# Altium schematic sheet Audio_Codec.SchDoc: Audio Research: Audio Codec
size A4; DrawnBy: Connor Dack; Engineer: Connor Dack; DocumentNumber: 4; Revision: 1.0; SheetNumber: 4; SheetTotal: 20
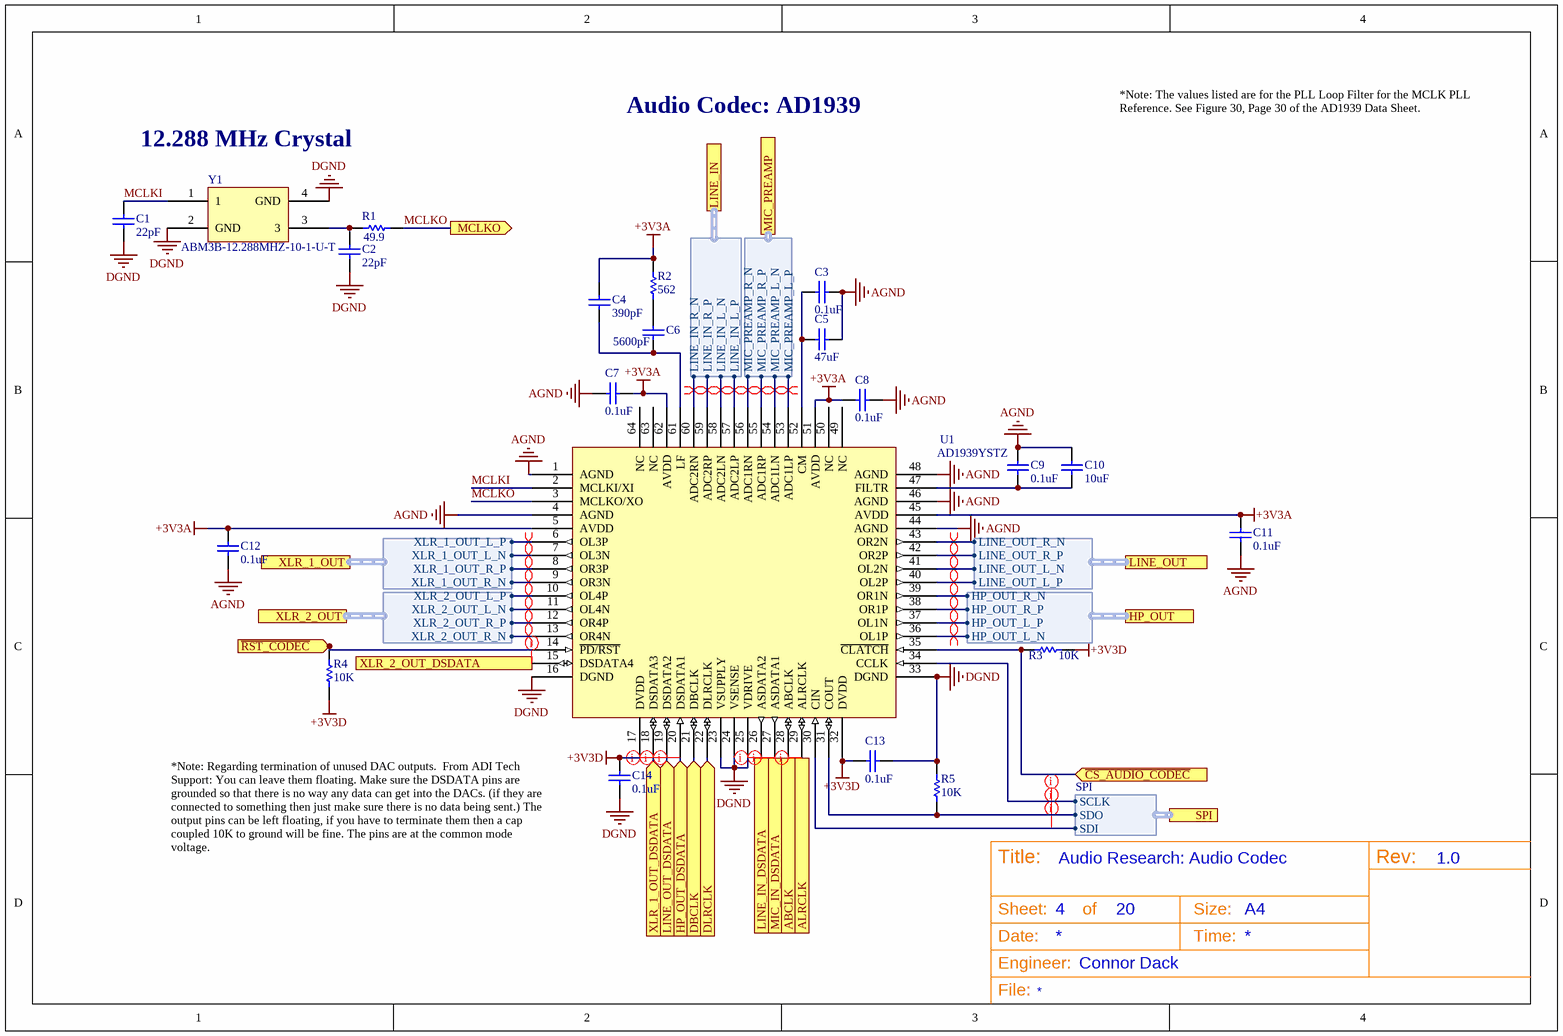
[diagram p0: Audio_Codec.SchDoc]

## Parts
C1  Capacitance: 22pF  [3-0603_L]  (hidden comment: CGA3E2C0G1H220J080AA)
C2  Capacitance: 22pF  [3-0603_L]  (hidden comment: CGA3E2C0G1H220J080AA)
C3  Capacitance: 0.1uF  [3-0603_L]  (hidden comment: CL10F104ZO8NNNC)
C4  Capacitance: 390pF  [3-0603_L]  (hidden comment: CL10B391KB8NNNC)
C5  Capacitance: 47uF  [C1210X25_L]  (hidden comment: CL32A476KOJNNNE)
C6  Capacitance: 5600pF  [3-0603_L]  (hidden comment: CL10B562KB8SFNC)
C7  Capacitance: 0.1uF  [3-0603_L]  (hidden comment: CL10F104ZO8NNNC)
C8  Capacitance: 0.1uF  [3-0603_L]  (hidden comment: CL10F104ZO8NNNC)
C9  Capacitance: 0.1uF  [3-0603_L]  (hidden comment: CL10F104ZO8NNNC)
C10  Capacitance: 10uF  [3-0603_L]  (hidden comment: GRM188R61A106ME69D)
C11  Capacitance: 0.1uF  [3-0603_L]  (hidden comment: CL10F104ZO8NNNC)
C12  Capacitance: 0.1uF  [3-0603_L]  (hidden comment: CL10F104ZO8NNNC)
C13  Capacitance: 0.1uF  [3-0603_L]  (hidden comment: CL10F104ZO8NNNC)
C14  Capacitance: 0.1uF  [3-0603_L]  (hidden comment: CL10F104ZO8NNNC)
R1  Resistance (Ohms): 49.9  [3-0603_R_L]  (hidden comment: ERJ-3EKF49R9V)
R2  Resistance (Ohms): 562  [3-0603_R_L]  (hidden comment: ERJ-3EKF5620V)
R3  Resistance (Ohms): 10K  [3-0603_R_L]  (hidden comment: ERJ-3GEYJ103V)
R4  Resistance (Ohms): 10K  [3-0603_R_L]  (hidden comment: ERJ-3GEYJ103V)
R5  Resistance (Ohms): 10K  [3-0603_R_L]  (hidden comment: ERJ-3GEYJ103V)
U1  AD1939YSTZ  [ST_64_2]
Y1  ABM3B-12.288MHZ-10-1-U-T  [ADM3B]

## Ports
ABCLK (out), ALRCLK (out), DBCLK (in), DLRCLK (in), HP_OUT (harness HP_OUT), HP_OUT_DSDATA (in), LINE_IN (harness LINE_IN), LINE_IN_DSDATA (out), LINE_OUT (harness LINE_OUT), LINE_OUT_DSDATA (in), MCLKO (out), MIC_IN_DSDATA (out), MIC_PREAMP (harness MIC_PREAMP), SPI (harness SPI), XLR_1_OUT (harness XLR_1_OUT), XLR_1_OUT_DSDATA (in), XLR_2_OUT (harness XLR_2_OUT), XLR_2_OUT_DSDATA (in), ~{CS_AUDIO_CODEC} (in), ~{RST_CODEC} (in)

## Harnesses
LINE_IN: LINE_IN_R_P, LINE_IN_R_N, LINE_IN_L_N, LINE_IN_L_P
HP_OUT: HP_OUT_L_N, HP_OUT_L_P, HP_OUT_R_N, HP_OUT_R_P
LINE_OUT: LINE_OUT_L_N, LINE_OUT_L_P, LINE_OUT_R_N, LINE_OUT_R_P
XLR_1_OUT: XLR_1_OUT_L_N, XLR_1_OUT_L_P, XLR_1_OUT_R_N, XLR_1_OUT_R_P
XLR_2_OUT: XLR_2_OUT_L_N, XLR_2_OUT_L_P, XLR_2_OUT_R_N, XLR_2_OUT_R_P
MIC_PREAMP: MIC_PREAMP_R_P, MIC_PREAMP_R_N, MIC_PREAMP_L_N, MIC_PREAMP_L_P
SPI: SDI, SCLK, SDO

## Nets
+3V3A: C4.1 C7.1 C8.2 C11.1 C12.1 R2.1 U1.5(AVDD) U1.45(AVDD) U1.51(AVDD) U1.62(AVDD)
+3V3D: C13.2 C14.1 R3.1 R4.1 U1.17(DVDD) U1.32(DVDD)
AGND: C3.1 C5.2 C7.2 C8.1 C9.1 C10.2 C11.2 C12.2 U1.1(AGND) U1.4(AGND) U1.44(AGND) U1.46(AGND) U1.48(AGND)
DGND: C1.1 C2.1 C13.1 C14.2 R5.1 U1.16(DGND) U1.23(VSUPPLY) U1.24(VSENSE) U1.25(VDRIVE) U1.33(DGND) Y1.2(GND) Y1.4(GND)
ABCLK: U1.28(ABCLK) ; port ABCLK
ALRCLK: U1.29(ALRCLK) ; port ALRCLK
~{CS_AUDIO_CODEC}: R3.2 U1.35(~{CLATCH}) ; port ~{CS_AUDIO_CODEC}
DBCLK: U1.21(DBCLK) ; port DBCLK
DLRCLK: U1.22(DLRCLK) ; port DLRCLK
HP_OUT_DSDATA: U1.20(DSDATA1) ; port HP_OUT_DSDATA
LINE_IN_DSDATA: U1.26(ASDATA2) ; port LINE_IN_DSDATA
LINE_OUT_DSDATA: U1.19(DSDATA2) ; port LINE_OUT_DSDATA
MCLKI: C1.2 U1.2(MCLKI/XI) Y1.1
MCLKO: R1.2 U1.3(MCLKO/XO) ; port MCLKO
MIC_IN_DSDATA: U1.27(ASDATA1) ; port MIC_IN_DSDATA
~{RST_CODEC}: R4.2 U1.14(~{PD/RST}) ; port ~{RST_CODEC}
XLR_1_OUT_DSDATA: U1.18(DSDATA3) ; port XLR_1_OUT_DSDATA
XLR_2_OUT_DSDATA: U1.15(DSDATA4) ; port XLR_2_OUT_DSDATA
NetC2_2: C2.2 R1.1 Y1.3
NetC3_2: C3.2 C5.1 U1.52(CM)
NetC4_2: C4.2 C6.2 U1.61(LF)
NetC6_1: C6.1 R2.2
NetC9_2: C9.2 C10.1 U1.47(FILTR)
NetR5_2: R5.2 U1.31(COUT) ; port SPI.SDO
NetU1_6: U1.6(OL3P) ; port XLR_1_OUT.XLR_1_OUT_L_P
NetU1_7: U1.7(OL3N) ; port XLR_1_OUT.XLR_1_OUT_L_N
NetU1_8: U1.8(OR3P) ; port XLR_1_OUT.XLR_1_OUT_R_P
NetU1_9: U1.9(OR3N) ; port XLR_1_OUT.XLR_1_OUT_R_N
NetU1_10: U1.10(OL4P) ; port XLR_2_OUT.XLR_2_OUT_L_P
NetU1_11: U1.11(OL4N) ; port XLR_2_OUT.XLR_2_OUT_L_N
NetU1_12: U1.12(OR4P) ; port XLR_2_OUT.XLR_2_OUT_R_P
NetU1_13: U1.13(OR4N) ; port XLR_2_OUT.XLR_2_OUT_R_N
NetU1_30: U1.30(CIN) ; port SPI.SDI
NetU1_34: U1.34(CCLK) ; port SPI.SCLK
NetU1_36: U1.36(OL1P) ; port HP_OUT.HP_OUT_L_N
NetU1_37: U1.37(OL1N) ; port HP_OUT.HP_OUT_L_P
NetU1_38: U1.38(OR1P) ; port HP_OUT.HP_OUT_R_P
NetU1_39: U1.39(OR1N) ; port HP_OUT.HP_OUT_R_N
NetU1_40: U1.40(OL2P) ; port LINE_OUT.LINE_OUT_L_P
NetU1_41: U1.41(OL2N) ; port LINE_OUT.LINE_OUT_L_N
NetU1_42: U1.42(OR2P) ; port LINE_OUT.LINE_OUT_R_P
NetU1_43: U1.43(OR2N) ; port LINE_OUT.LINE_OUT_R_N
NetU1_53: U1.53(ADC1LP) ; port MIC_PREAMP.MIC_PREAMP_L_P
NetU1_54: U1.54(ADC1LN) ; port MIC_PREAMP.MIC_PREAMP_L_N
NetU1_55: U1.55(ADC1RP) ; port MIC_PREAMP.MIC_PREAMP_R_P
NetU1_56: U1.56(ADC1RN) ; port MIC_PREAMP.MIC_PREAMP_R_N
NetU1_57: U1.57(ADC2LP) ; port LINE_IN.LINE_IN_L_P
NetU1_58: U1.58(ADC2LN) ; port LINE_IN.LINE_IN_L_N
NetU1_59: U1.59(ADC2RP) ; port LINE_IN.LINE_IN_R_P
NetU1_60: U1.60(ADC2RN) ; port LINE_IN.LINE_IN_R_N

Not connected (* = marked no-connect by the designer): U1 49(NC) 50(NC) 63(NC) 64(NC)

## Layout directives
differential pair: NetU1_6, NetU1_7, NetU1_8, NetU1_9, NetU1_10, NetU1_11, NetU1_12, NetU1_13, NetU1_36, NetU1_37, NetU1_38, NetU1_39, NetU1_40, NetU1_41, NetU1_42, NetU1_43, NetU1_53, NetU1_54, NetU1_55, NetU1_56, NetU1_57, NetU1_58, NetU1_59, NetU1_60
net class SPI: NetR5_2, NetU1_30, NetU1_34
net class FPGA_Audio_In: ALRCLK, LINE_IN_DSDATA, MIC_IN_DSDATA
net class FPGA_Audio_Out: HP_OUT_DSDATA, LINE_OUT_DSDATA, XLR_1_OUT_DSDATA, XLR_2_OUT_DSDATA

## Notes on the sheet
- Audio Codec: AD1939
- *Note: The values listed are for the PLL Loop Filter for the MCLK PLL Reference. See Figure 30, Page 30 of the AD1939 Data Sheet.
- 12.288 MHz Crystal
- *Note: Regarding termination of unused DAC outputs.  From ADI Tech Support: You can leave them floating. Make sure the DSDATA pins are grounded so that there is no way any data can get into the DACs. (if they are connected to something then just make sure there is no data being sent.) The output pins can be left floating, if you have to terminate them then a cap coupled 10K to ground will be fine. The pins are at the common mode voltage.
- Title:
- Sheet:
- of
- Size:
- A4
- Rev:
- Date:
- Engineer:
- Time:
- File:

## Library data of the parts
C1 C2 = CGA3E2C0G1H220J080AA: CAP CER 22PF 50V C0G 0603; Manufacturer: TDK; Tolerance: 5%; ComponentLink1URL: https://datasheet.ciiva.com/24217/cga3e2c0g1h220j080aa-265896-24217329.pdf; ComponentLink1Description: https://datasheet.ciiva.com/24217/cga3e2c0g1h220j080aa-265896-24217329.pdf; Supplier 1: Digi-Key; Manufacturer Part Number: CGA3E2C0G1H220J080AA; Stock 1: 26658; Pricing 1: 1=0.1, 10=0.063, 100=0.0279, 500=0.0199, 1000=0.0156 (USD); Mount: Surface Mount; Case/Package: 0603; Weight: 7.1E-05oz; Case Code (Imperial): 0603; Case Code (Metric): 1608; Min Operating Temperature: -55°C; Max Operating Temperature: 125°C; Voltage Rating (DC): 50V; Packaging: Tape and Reel; Package Quantity: 1; Voltage Rating: 50V; Dielectric: C0G; Termination: SMD/SMT; Composition: Ceramic; Length: 1.6mm; Height: 0.8mm; Width: 0.8mm; Thickness: 0.035inch; Depth: 0.8mm; REACH SVHC: No SVHC; Lead Free: Lead Free; Supplier Part Number 1: 445-5632-6-ND
C3 C7-C9 C11-C14 = CL10F104ZO8NNNC: CAP CER 0.1UF 16V Y5V 0603; Manufacturer: Samsung; Tolerance: 80%; Supplier 1: Digi-Key; Stock 1: 40000; Pricing 1: 1=0.1, 10=0.038, 100=0.0169, 500=0.01208, 1000=0.00949 (USD); Mount: Surface Mount; Case/Package: 0603; Case Code (Metric): 1608; Case Code (Imperial): 0603; Min Operating Temperature: -30°C; Max Operating Temperature: 85°C; Package Quantity: 1; Packaging: Tape and Reel; Voltage Rating: 16V; Dielectric: Y5V; Length: 1.6mm; Height: 0.8mm; Width: 0.031inch; Thickness: 0.035inch; Depth: 0.8mm; Radiation Hardening: No; ComponentLink1URL: https://datasheet.ciiva.com/25805/cl10f104zo8nnnc-25805810.pdf; ComponentLink1Description: https://datasheet.ciiva.com/25805/cl10f104zo8nnnc-25805810.pdf; ComponentLink2URL: https://datasheet.ciiva.com/16199/cl10f104zo8nnnc-16199254.pdf; ComponentLink2Description: https://datasheet.ciiva.com/16199/cl10f104zo8nnnc-16199254.pdf; Supplier Part Number 1: 1276-1258-6-ND; Manufacturer Part Number: CL10F104ZO8NNNC
C4 = CL10B391KB8NNNC: 390pF 50V Ceramic Capacitor X7R 0603 (1608 Metric) 0.063" L x 0.031" W (1.60mm x 0.80mm); Manufacturer: Samsung Electro-Mechanics America, Inc.; Tolerance: ±10%; Supplier 1: Digi-Key; Manufacturer Part Number: CL10B391KB8NNNC; RoHS: RoHS Compliant; Category: Capacitors; Stock 1: 10890; Pricing 1: 1=0.1, 10=0.035, 25=0.0248, 50=0.0192, 100=0.0162, 500=0.01132, 1000=0.00882 (USD); Packaging: Cut Tape (CT); Part Status: Active; Voltage - Rated: 50V; Temperature Coefficient: X7R; Mounting Type: Surface Mount, MLCC; Operating Temperature: -55°C ~ 125°C; Applications: General Purpose; Ratings: -; Package / Case: 0603 (1608 Metric); Size / Dimension: 0.063" L x 0.031" W (1.60mm x 0.80mm); Height - Seated (Max): -; Thickness (Max): 0.035" (0.90mm); Lead Spacing: -; Features: -; Lead Style: -; ComponentLink1URL: http://www.samsungsem.com/kr/support/product-search/mlcc/__icsFiles/afieldfile/2016/08/18/S_CL10B391KB8NNNC.pdf; ComponentLink1Description: http://www.samsungsem.com/kr/support/product-search/mlcc/__icsFiles/afieldfile/2016/08/18/S_CL10B391KB8NNNC.pdf; Supplier Part Number 1: 1276-2049-1-ND
C5 = CL32A476KOJNNNE: CAP CER 47UF 16V X5R 1210; Manufacturer: Samsung; Tolerance: 10%; Supplier 1: Digi-Key; Manufacturer Part Number: CL32A476KOJNNNE; Stock 1: 10000; Pricing 1: 1=1.12, 10=0.853, 100=0.6104, 500=0.47254 (USD); Mount: Surface Mount; Case/Package: 1210; Case Code (Metric): 3225; Case Code (Imperial): 1210; Min Operating Temperature: -55°C; Max Operating Temperature: 85°C; Package Quantity: 1; Packaging: Tape and Reel; Voltage Rating: 16V; Dielectric: X5R; Voltage Rating (DC): 16V; Length: 0.126inch; Width: 0.098inch; Thickness: 0.106inch; Lead Free: Lead Free; ComponentLink1URL: https://datasheet.ciiva.com/25785/cl32a476kojnnne-25785873.pdf; ComponentLink1Description: https://datasheet.ciiva.com/25785/cl32a476kojnnne-25785873.pdf; Supplier Part Number 1: 1276-3376-6-ND
C6 = CL10B562KB8SFNC: 5600pF 50V Ceramic Capacitor X7R 0603 (1608 Metric) 0.063" L x 0.031" W (1.60mm x 0.80mm); Manufacturer: Samsung Electro-Mechanics America, Inc.; Tolerance: ±10%; Notes: FE Provides; Supplier 1: Digi-Key; Manufacturer Part Number: CL10B562KB8SFNC; RoHS: RoHS Compliant; Category: Capacitors; Stock 1: 35381; Pricing 1: 1=0.1, 10=0.048, 25=0.034, 50=0.0262, 100=0.0221, 500=0.01548, 1000=0.01206 (USD); Packaging: Cut Tape (CT); Part Status: Active; Voltage - Rated: 50V; Temperature Coefficient: X7R; Mounting Type: Surface Mount, MLCC; Operating Temperature: -55°C ~ 125°C; Applications: Boardflex Sensitive; Ratings: -; Package / Case: 0603 (1608 Metric); Size / Dimension: 0.063" L x 0.031" W (1.60mm x 0.80mm); Height - Seated (Max): -; Thickness (Max): 0.035" (0.90mm); Lead Spacing: -; Features: Soft Termination; Lead Style: -; ComponentLink1URL: http://www.samsungsem.com/kr/support/product-search/mlcc/__icsFiles/afieldfile/2016/08/18/S_CL10B562KB8SFNC.pdf; ComponentLink1Description: http://www.samsungsem.com/kr/support/product-search/mlcc/__icsFiles/afieldfile/2016/08/18/S_CL10B562KB8SFNC.pdf; Supplier Part Number 1: 1276-2092-1-ND
C10 = GRM188R61A106ME69D: CAP CER 10UF 10V X5R 0603; Manufacturer: Murata; Material: Ceramic; Tolerance: 20%; Supplier 1: Digi-Key; Manufacturer Part Number: GRM188R61A106ME69D; Stock 1: 40000; Pricing 1: 1=0.22, 10=0.149, 100=0.0754, 500=0.05158, 1000=0.04563 (USD); Mount: Surface Mount; Case/Package: 0603; Weight: 0.000222oz; Case Code (Metric): 1608; Case Code (Imperial): 0603; Min Operating Temperature: -55°C; Max Operating Temperature: 85°C; Packaging: Tape and Reel; Voltage Rating: 10V; Dielectric: X5R; Termination: SMD/SMT; Voltage Rating (DC): 10V; Package Quantity: 4000; Length: 1.6mm; Height: 0.8mm; Width: 0.8mm; Thickness: 0.035inch; Depth: 0.8mm; REACH SVHC: Unknown; Lead Free: Lead Free; ComponentLink1URL: http://components.arrow.com/part/dataview/0323_06119472; ComponentLink1Description: http://components.arrow.com/part/dataview/0323_06119472; ComponentLink2URL: http://www.farnell.com/datasheets/2048014.pdf; ComponentLink2Description: http://www.farnell.com/datasheets/2048014.pdf; ComponentLink3URL: http://search.murata.co.jp/Ceramy/image/img/A01X/G101/ENG/GRM188R61A106ME69-01.pdf; ComponentLink3Description: http://search.murata.co.jp/Ceramy/image/img/A01X/G101/ENG/GRM188R61A106ME69-01.pdf; ComponentLink4URL: http://www.mouser.com/ds/2/281/c02e-2905.pdf; ComponentLink4Description: http://www.mouser.com/ds/2/281/c02e-2905.pdf; ComponentLink5URL: http://www.farnell.com/datasheets/1872210.pdf; ComponentLink5Description: http://www.farnell.com/datasheets/1872210.pdf; Supplier Part Number 1: 490-10475-6-ND
R1 = ERJ-3EKF49R9V: RES SMD 49.9 OHM 1% 1/10W 0603; Manufacturer: Panasonic Electronic Components; Power (Watts): 0.1W, 1/10W; Temperature Coefficient: ±100ppm/°C; Notes: FE Provides; Supplier 1: Digi-Key; RoHS: RoHS Compliant; Category: Resistors; Stock 1: 1715606; Pricing 1: 1=0.1, 10=0.019, 25=0.0136, 50=0.0104, 100=0.0077, 250=0.00584, 500=0.00468, 1000=0.00345 (USD); Packaging: Cut Tape (CT); Part Status: Active; Tolerance: ±1%; Composition: Thick Film; Features: Automotive AEC-Q200; Operating Temperature: -55°C ~ 155°C; Package / Case: 0603 (1608 Metric); Supplier Device Package: 0603; Size / Dimension: 0.063" L x 0.031" W (1.60mm x 0.80mm); Height - Seated (Max): 0.022" (0.55mm); Number of Terminations: 2; Failure Rate: -; ComponentLink1URL: http://industrial.panasonic.com/www-cgi/jvcr13pz.cgi?E+PZ+3+AOA0002+ERJ3EKF49R9V+7+WW; ComponentLink1Description: http://industrial.panasonic.com/www-cgi/jvcr13pz.cgi?E+PZ+3+AOA0002+ERJ3EKF49R9V+7+WW; Supplier Part Number 1: P49.9HCT-ND
R2 = ERJ-3EKF5620V: RES SMD 562 OHM 1% 1/10W 0603; Manufacturer: Panasonic Electronic Components; Power (Watts): 0.1W, 1/10W; Temperature Coefficient: ±100ppm/°C; Supplier 1: Digi-Key; Manufacturer Part Number: ERJ-3EKF5620V; RoHS: RoHS Compliant; Category: Resistors; Stock 1: 336376; Pricing 1: 1=0.1, 50=0.0114, 100=0.0084, 250=0.00644, 500=0.00514, 1000=0.00379 (USD); Packaging: Cut Tape (CT); Part Status: Active; Tolerance: ±1%; Composition: Thick Film; Features: Automotive AEC-Q200; Operating Temperature: -55°C ~ 155°C; Package / Case: 0603 (1608 Metric); Supplier Device Package: 0603; Size / Dimension: 0.063" L x 0.031" W (1.60mm x 0.80mm); Height: 0.022" (0.55mm); Number of Terminations: 2; Failure Rate: -; ComponentLink1URL: http://industrial.panasonic.com/www-cgi/jvcr13pz.cgi?E+PZ+3+AOA0002+ERJ3EKF5620V+7+WW; ComponentLink1Description: http://industrial.panasonic.com/www-cgi/jvcr13pz.cgi?E+PZ+3+AOA0002+ERJ3EKF5620V+7+WW; Supplier Part Number 1: P562HCT-ND
R3-R5 = ERJ-3GEYJ103V: RES 10K OHM 1/10W 5% 0603 SMD; Manufacturer: Panasonic - ECG; Power (Watts): 0.1W, 1/10W; Temperature Coefficient: ±200ppm/°C; Supplier 1: Digi-Key; Manufacturer Part Number: ERJ-3GEYJ103V; RoHS: RoHS Compliant; Category: Resistors; Stock 1: 16219504; Pricing 1: 1=0.02, 50=0.0092, 100=0.007, 250=0.0052, 500=0.00384, 1000=0.00256 (USD); Composition: Thick Film; Features: -; Tolerance: ±5%; Package / Case: 0603 (1608 Metric); Size / Dimension: 0.063" L x 0.031" W (1.60mm x 0.80mm); Height: 0.022" (0.55mm); Number of Terminations: 2; Packaging: Cut Tape (CT); ComponentLink1URL: http://industrial.panasonic.com/www-cgi/jvcr13pz.cgi?E+PZ+3+AOA0001+ERJ3GEYJ103V+7+WW; ComponentLink1Description: http://industrial.panasonic.com/www-cgi/jvcr13pz.cgi?E+PZ+3+AOA0001+ERJ3GEYJ103V+7+WW; Supplier Part Number 1: P10KGCT-ND
U1 = AD1939YSTZ: Single-chip codec that prvides 4 ADCs with differential input and 8 DACs with differential output; Manufacturer: Analog Devices Inc.; Data Interface: Serial; Resolution (Bits): 24 b; Number of ADCs / DACs: 4 / 8; Sigma Delta: Yes; S/N Ratio, ADCs / DACs (db) Typ: 94 / 94; Dynamic Range, ADCs / DACs (db) Typ: 105 / 110; Voltage - Supply, Analog: 3 V ~ 3.6 V; Notes: FE Provides; Supplier 1: Digi-Key; RoHS: RoHS Compliant; Category: Integrated Circuits (ICs); Stock 1: 432; Pricing 1: 1=15.81, 10=14.527, 100=12.269, 500=10.91416, 1000=10.01091, 2500=9.63456, 5000=9.33348 (USD); Packaging: Tray; Type: General Purpose; Voltage - Supply, Digital: 3 V ~ 3.6 V; Operating Temperature: -40°C ~ 105°C; Mounting Type: Surface Mount; Package / Case: 64-LQFP; Supplier Device Package: 64-LQFP (10x10); ComponentLink1URL: http://www.analog.com/media/en/technical-documentation/data-sheets/AD1939.pdf; ComponentLink1Description: http://www.analog.com/media/en/technical-documentation/data-sheets/AD1939.pdf; Supplier Part Number 1: AD1939YSTZ-ND; Manufacturer Part Number: AD1939YSTZ
Y1 = ABM3B-12.288MHZ-10-1-U-T: 12.288MHz ±10ppm Crystal 10pF 70 Ohm -10°C ~ 60°C Surface Mount 4-SMD, No Lead (DFN, LCC); Manufacturer: Abracon LLC; ESR (Equivalent Series Resistance): 70 Ohm; Operating Mode: Fundamental; Notes: FE Provides; Supplier 1: Digi-Key; RoHS: RoHS Compliant; Category: Crystals and Oscillators; Stock 1: 1220; Pricing 1: 1=1.09, 10=0.968, 50=0.904, 100=0.8, 500=0.756 (USD); Packaging: Cut Tape (CT); Part Status: Active; Type: MHz Crystal; Frequency: 12.288MHz; Frequency Stability: ±10ppm; Frequency Tolerance: ±10ppm; Load Capacitance: 10pF; Operating Temperature: -10°C ~ 60°C; Ratings: -; Mounting Type: Surface Mount; Package / Case: 4-SMD, No Lead (DFN, LCC); Size / Dimension: 0.197" L x 0.126" W (5.00mm x 3.20mm); Height: 0.043" (1.10mm); ComponentLink1URL: http://www.abracon.com/Resonators/abm3b.pdf; ComponentLink1Description: http://www.abracon.com/Resonators/abm3b.pdf; Supplier Part Number 1: 300-8198-1-ND; Manufacturer Part Number: ABM3B-12.288MHZ-10-1-U-T